# Altium schematic sheet adc_dac_main6.SchDoc: mcHF QRP Transceiver UI board
size A4; Author: K Atanassov; CompanyName: M0NKA; Revision: 0.6.3; SheetTotal: 5
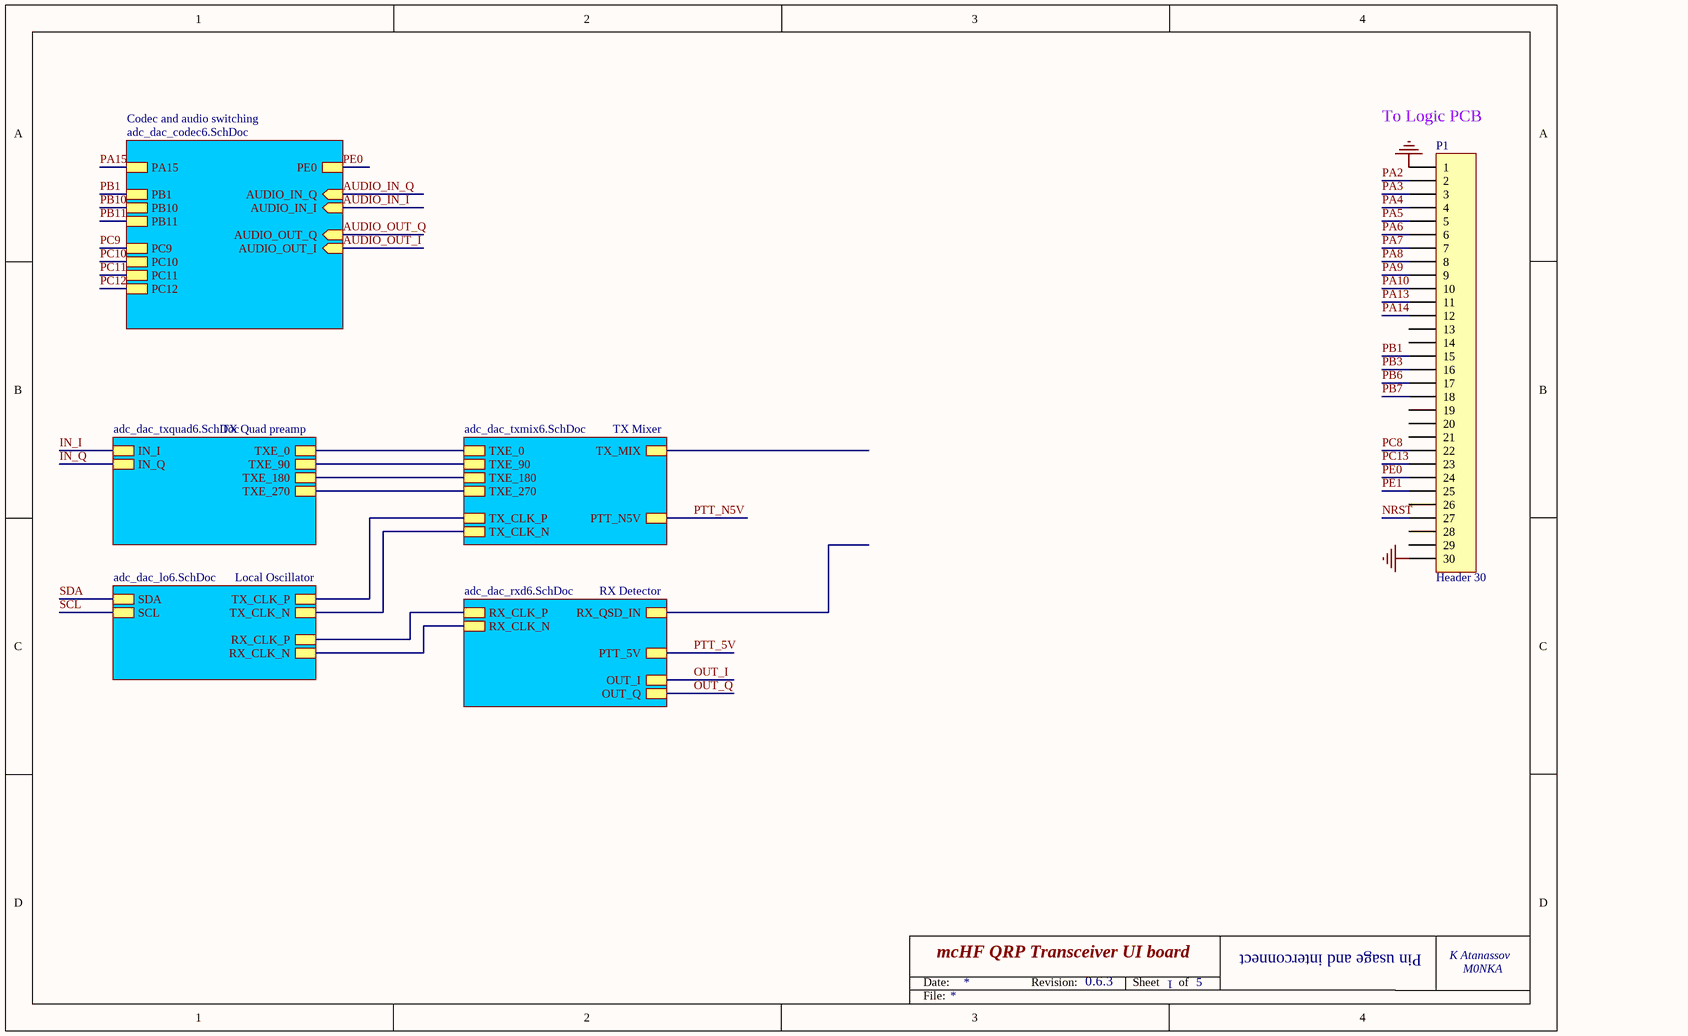
[diagram p0: adc_dac_main6.SchDoc]

## Parts
P1  Header 30  [HDR1X30]

## Sub-sheets
Codec and audio switching = adc_dac_codec6.SchDoc: PA15, PB1, PB10, PB11, PC9, PC11, PC10, PC12, PE0, AUDIO_IN_Q (in), AUDIO_IN_I (in), AUDIO_OUT_Q (in), AUDIO_OUT_I (in)
Local Oscillator = adc_dac_lo6.SchDoc: SDA, SCL, RX_CLK_N, RX_CLK_P, TX_CLK_P, TX_CLK_N
RX Detector = adc_dac_rxd6.SchDoc: RX_QSD_IN, OUT_I, OUT_Q, PTT_5V, RX_CLK_N, RX_CLK_P
TX Mixer = adc_dac_txmix6.SchDoc: PTT_N5V, TX_MIX, TXE_270, TXE_180, TXE_90, TXE_0, TX_CLK_P, TX_CLK_N
TX Quad preamp = adc_dac_txquad6.SchDoc: IN_I, IN_Q, TXE_0, TXE_90, TXE_180, TXE_270

## Nets
GND: P1.1 P1.30
AUDIO_IN_I: sheet Codec and audio switching/AUDIO_IN_I
AUDIO_IN_Q: sheet Codec and audio switching/AUDIO_IN_Q
AUDIO_OUT_I: sheet Codec and audio switching/AUDIO_OUT_I
AUDIO_OUT_Q: sheet Codec and audio switching/AUDIO_OUT_Q
IN_I: sheet TX Quad preamp/IN_I
IN_Q: sheet TX Quad preamp/IN_Q
NRST: P1.27
OUT_I: sheet RX Detector/OUT_I
OUT_Q: sheet RX Detector/OUT_Q
PA2: P1.2
PA3: P1.3
PA4: P1.4
PA5: P1.5
PA6: P1.6
PA7: P1.7
PA8: P1.8
PA9: P1.9
PA10: P1.10
PA13: P1.11
PA14: P1.12
PA15: sheet Codec and audio switching/PA15
PB1: P1.15 ; sheet Codec and audio switching/PB1
PB3: P1.16
PB6: P1.17
PB7: P1.18
PB10: sheet Codec and audio switching/PB10
PB11: sheet Codec and audio switching/PB11
PC8: P1.22
PC9: sheet Codec and audio switching/PC9
PC10: sheet Codec and audio switching/PC10
PC11: sheet Codec and audio switching/PC11
PC12: sheet Codec and audio switching/PC12
PC13: P1.23
PE0: P1.24 ; sheet Codec and audio switching/PE0
PE1: P1.25
PTT_5V: sheet RX Detector/PTT_5V
PTT_N5V: sheet TX Mixer/PTT_N5V
SCL: sheet Local Oscillator/SCL
SDA: sheet Local Oscillator/SDA
(unnamed): sheet TX Quad preamp/TXE_0, sheet TX Mixer/TXE_0
(unnamed): sheet TX Quad preamp/TXE_90, sheet TX Mixer/TXE_90
(unnamed): sheet TX Quad preamp/TXE_180, sheet TX Mixer/TXE_180
(unnamed): sheet TX Quad preamp/TXE_270, sheet TX Mixer/TXE_270
(unnamed): sheet RX Detector/RX_CLK_N, sheet Local Oscillator/RX_CLK_N
(unnamed): sheet RX Detector/RX_CLK_P, sheet Local Oscillator/RX_CLK_P
(unnamed): sheet Local Oscillator/TX_CLK_P, sheet TX Mixer/TX_CLK_P
(unnamed): sheet Local Oscillator/TX_CLK_N, sheet TX Mixer/TX_CLK_N

Not connected (* = marked no-connect by the designer): P1 13 14 19 20 21 26 28 29

## Notes on the sheet
- (near P1) To Logic PCB
- 1
- Pin usage and interconnect
- Date:
- Revision:
- Sheet
- of
- File:

## Library data of the parts
P1 = Header 30: Header, 30-Pin; Order: NA; Price: 0.295